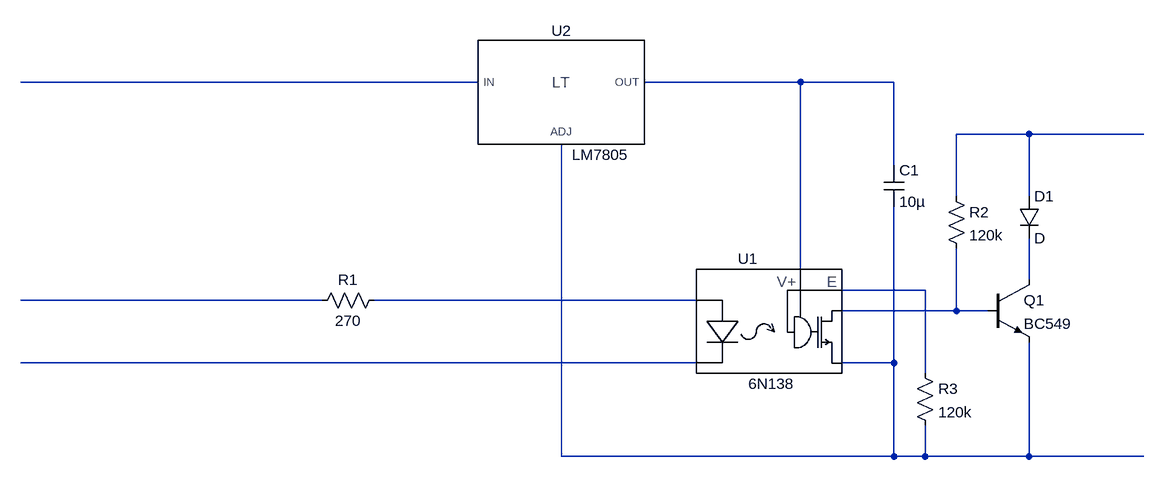
[diagram p0: schematic tty-opto-current-switch.asc]
tty-opto-current-switch.asc, the LTspice schematic file:
Version 4
SHEET 1 880 760
WIRE -160 176 -864 176
WIRE 336 176 96 176
WIRE 480 176 336 176
WIRE 688 256 576 256
WIRE 864 256 688 256
WIRE 480 304 480 176
WIRE 576 352 576 256
WIRE 688 352 688 256
WIRE 336 464 336 176
WIRE 688 480 688 416
WIRE 528 496 400 496
WIRE -400 512 -864 512
WIRE 176 512 -320 512
WIRE 576 528 576 432
WIRE 576 528 400 528
WIRE 624 528 576 528
WIRE 176 608 -864 608
WIRE 480 608 480 368
WIRE 480 608 400 608
WIRE 528 624 528 496
WIRE -32 752 -32 272
WIRE 480 752 480 608
WIRE 480 752 -32 752
WIRE 528 752 528 704
WIRE 528 752 480 752
WIRE 688 752 688 576
WIRE 688 752 528 752
WIRE 864 752 688 752
SYMBOL Optos/6N138 272 560 R0
SYMATTR InstName U1
SYMBOL PowerProducts/LM7805 -32 176 R0
SYMATTR InstName U2
SYMBOL cap 464 304 R0
SYMATTR InstName C1
SYMATTR Value 10µ
SYMBOL res -304 496 R90
WINDOW 0 0 56 VBottom 2
WINDOW 3 32 56 VTop 2
SYMATTR InstName R1
SYMATTR Value 270
SYMBOL npn 624 480 R0
SYMATTR InstName Q1
SYMATTR Value BC549
SYMBOL res 560 336 R0
SYMATTR InstName R2
SYMATTR Value 120k
SYMBOL diode 672 352 R0
SYMATTR InstName D1
SYMBOL res 512 608 R0
SYMATTR InstName R3
SYMATTR Value 120k

The netlist it stands for:
* tty-opto-current-switch.asc
XU1 N007 N009 N010 N008 N002 N005 6N138  ; pins A K S C V E
XU2 N010 N002 N001 LM7805  ; pins ADJ OUT IN
C1 N002 N010 10µ
R1 N007 N006 270
Q1 N004 N008 N010 0 BC549
R2 N003 N008 120k
D1 N003 N004 D
R3 N005 N010 120k
.model D D
.lib standard.dio
.model NPN NPN
.model PNP PNP
.lib standard.bjt
.lib 6N138.SUB
.lib regulators.lib
.backanno
.end